# Altium schematic sheet 4_OLED.schdoc.schdoc
size 309 x 223 mm; Symbol: Sheet-Symbol_A4; Device: Sheet-Symbol_A4; @Page Name: OLED; @Create Date: 2023-12-01; @Page Count: 8; @Page No: 8; @Project Name: STM32F722RET6; @Schematic Name: 开发板; @Update Date: 2023-12-01; Company: 嘉立创EDA; Page Size: A4; Version: V1.0
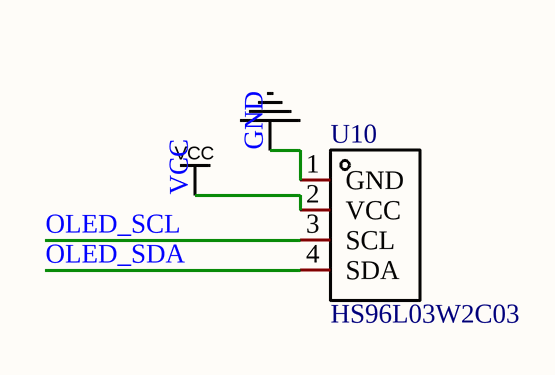
[diagram p0: 4_OLED.schdoc.schdoc]

## Parts
U10  HS96L03W2C03  [OLED-TH_L27.8-W27.2-P2.54_C9900033791]

## Nets
GND: U10.1(GND)
VCC: U10.2(VCC)
OLED_SCL: U10.3(SCL)
OLED_SDA: U10.4(SDA)

## Notes on the sheet
- 1
- 2
- 3
- 4
- 5
- 6
- A
- B
- C
- 原理图
- 开发板
- 创建日期
- 更新日期
- 2023-12-01
- 审阅
- 绘制
- 图页
- OLED
- 物料编码
- STM32F722RET6
- D
- 版本
- 尺寸
- 页
- 8
- 共
- V1.0
- A4
- 嘉立创EDA

## Library data of the parts
U10 = HS96L03W2C03: 尺寸(inch)：0.96寸 0.96&apos; 像素分辨率：128x64 128*64主控芯片：SSD1315 接口类型：I2C 外形:27.3*27.8；IIC/3SPI/4SPI串口通讯,工作温度范围-40℃—+70℃。4PIN黑底白光。; Manufacturer: HS(汉昇); Add into BOM: yes; Name: HS96L03W2C03; Symbol: HS96L03W2C03; Device: HS96L03W2C03; LCSC Part Name: 0.96寸OLED显示屏窄白光IIC; Supplier Part: C5248080; Manufacturer Part: HS96L03W2C03; Supplier Footprint: -; JLCPCB Part Class: 扩展库; Datasheet: https://atta.szlcsc.com/upload/public/pdf/source/20230627/763D01F79A90007632F098068C7C8AD9.pdf; Supplier: LCSC; Convert to PCB: yes